# Altium schematic sheet PF1_Alim.SchDoc
size 254 x 228 mm
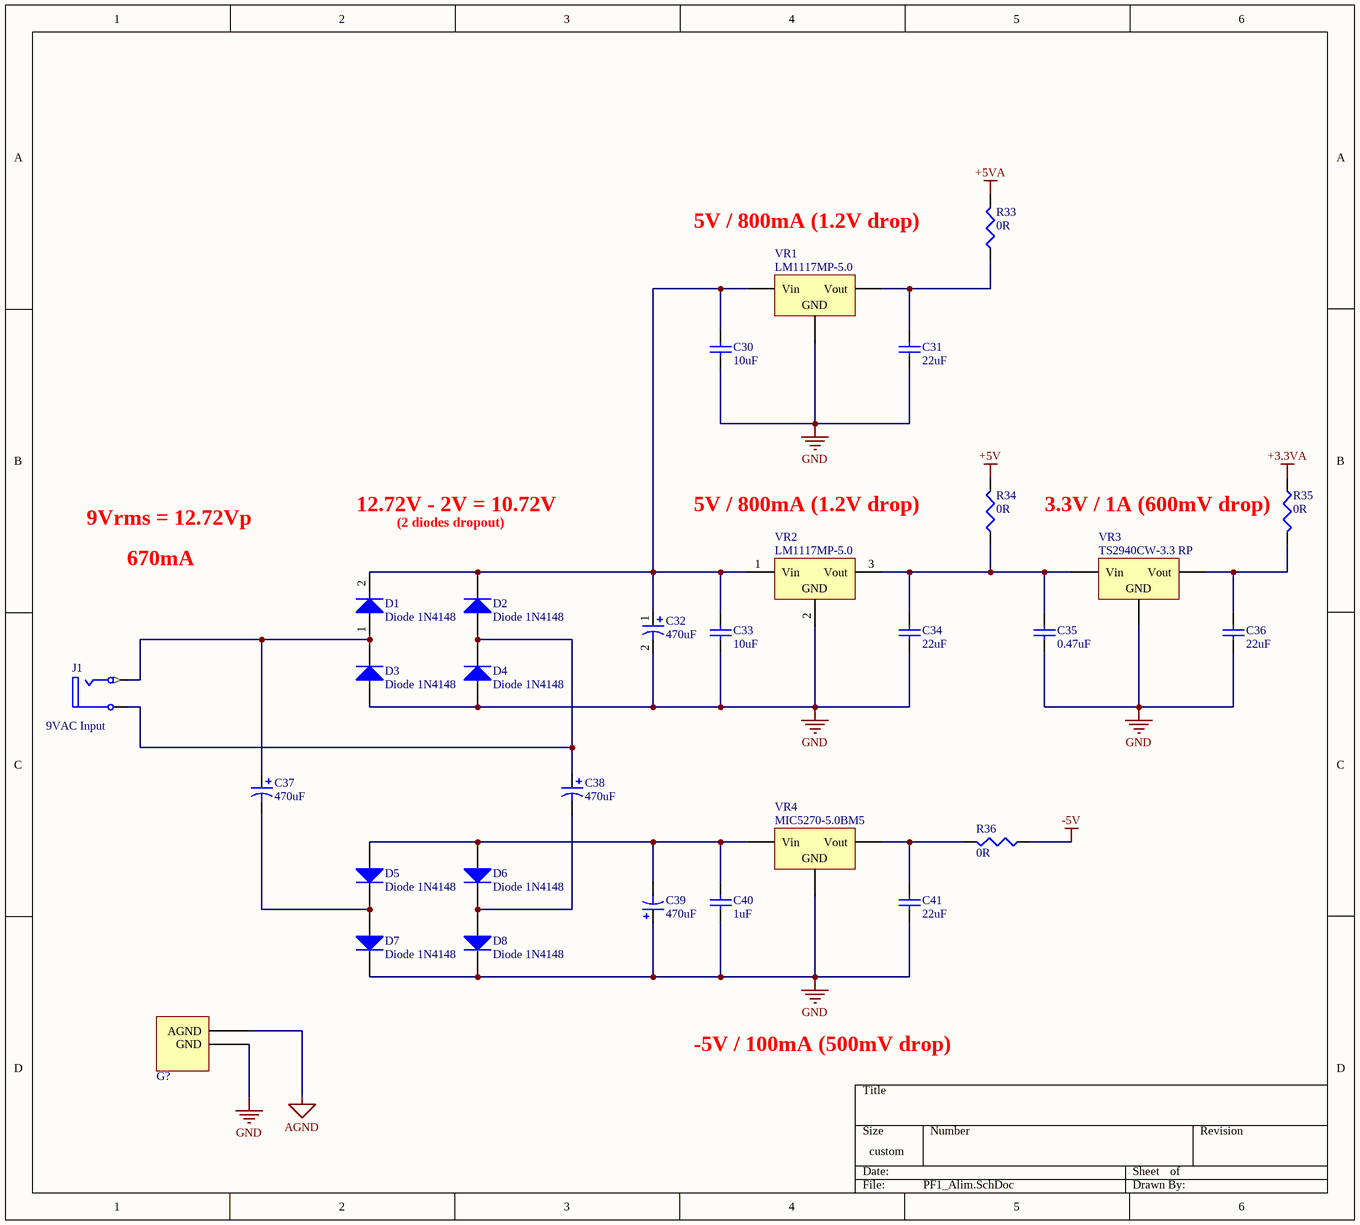
[diagram p0: PF1_Alim.SchDoc]

## Parts
C30  10uF  [CAP 0603 (1608 metric)]
C31  22uF  [CAP 0603 (1608 metric)]
C32  470uF  [Condo Electro 5mm]
C33  10uF  [CAP 0603 (1608 metric)]
C34  22uF  [CAP 0603 (1608 metric)]
C35  0.47uF  [CAP 0603 (1608 metric)]
C36  22uF  [CAP 0603 (1608 metric)]
C37  470uF  [Condo Electro 5mm]
C38  470uF  [Condo Electro 5mm]
C39  470uF  [Condo Electro 5mm]
C40  1uF  [CAP 0603 (1608 metric)]
C41  22uF  [CAP 0603 (1608 metric)]
D1  Diode 1N4148  [1N4148]
D2  Diode 1N4148  [1N4148]
D3  Diode 1N4148  [1N4148]
D4  Diode 1N4148  [1N4148]
D5  Diode 1N4148  [1N4148]
D6  Diode 1N4148  [1N4148]
D7  Diode 1N4148  [1N4148]
D8  Diode 1N4148  [1N4148]
G?  Ground Connector  [GND]  (value not drawn)
J1  9VAC Input  [CLIFF ELECTRONIC COMPONENTS_FC681465P]
R33  0R  [RES 0603 (1608 metric)]
R34  0R  [RES 0603 (1608 metric)]
R35  0R  [RES 0603 (1608 metric)]
R36  0R  [RES 0603 (1608 metric)]
VR1  LM1117MP-5.0  [MP04A]
VR2  LM1117MP-5.0  [MP04A]
VR3  TS2940CW-3.3 RP  [SOT230P715X180-4N]
VR4  MIC5270-5.0BM5  [SOT95P280X130-5N]

## Nets
+3.3VA: R35.1
+5V: R34.2
+5VA: R33.2
-5V: R36.1
AGND: G?.1(AGND)
GND: C30.1 C31.1 C32.2 C33.1 C34.1 C35.1 C36.1 C39.1 C40.1 C41.1 D3.1(A) D4.1(A) D7.2(K) D8.2(K) G?.2(GND) VR1.2(GND) VR2.2(GND) VR3.2(GND) VR4.2(GND)
NetC30_2: C30.2 C32.1 C33.2 D1.2(K) D2.2(K) VR1.1(Vin) VR2.1(Vin)
NetC31_2: C31.2 R33.1 VR1.3(Vout)
NetC34_2: C34.2 C35.2 R34.1 VR2.3(Vout) VR3.1(Vin)
NetC36_2: C36.2 R35.2 VR3.3(Vout)
NetC37_1: C37.1 D1.1(A) D3.2(K) J1.1(T)
NetC37_2: C37.2 D5.2(K) D7.1(A)
NetC38_1: C38.1 D2.1(A) D4.2(K) J1.5(S)
NetC38_2: C38.2 D6.2(K) D8.1(A)
NetC39_2: C39.2 C40.2 D5.1(A) D6.1(A) VR4.1(Vin)
NetC41_2: C41.2 R36.2 VR4.3(Vout)

## Notes on the sheet
- 5V / 800mA (1.2V drop)
- 9Vrms = 12.72Vp
- 670mA
- 12.72V - 2V = 10.72V
- (2 diodes dropout)
- (near R35) 3.3V / 1A (600mV drop)
- -5V / 100mA (500mV drop)

## Library data of the parts
C30 C33 = Cap Semi: Capacitor (Semiconductor SIM Model); Fabricant: MURATA; Fournisseur: Farnell; RefFabricant: GRM188R60J106ME47J; RefFournisseur: 2611921; Value: 10uF; Case: 0603 [1608 Metric]; DataSheet: http://www.farnell.com/datasheets/2079165.pdf
C31 C34 C36 C41 = Cap Semi: Capacitor (Semiconductor SIM Model); Fabricant: MURATA; Fournisseur: Farnell; RefFabricant: GRM188R60J226MEA0D; RefFournisseur: 2666490; Value: 22uF; Case: 0603 [1608 Metric]; DataSheet: http://www.farnell.com/datasheets/1955681.pdf
C32 C37 C38 = Cap Pol1: Polarized Capacitor (Radial); Fabricant: PANASONIC ELECTRONIC COMPONENTS; Fournisseur: Farnell; RefFabricant: EEEFK1E471P; RefFournisseur: 9695800; Value: 470uF; Case: [10mm]; DataSheet: http://www.farnell.com/datasheets/2002520.pdf
C35 = Cap Semi: Capacitor (Semiconductor SIM Model); Fabricant: MURATA; Fournisseur: Farnell; RefFabricant: GRM188R61A474KA61D; RefFournisseur: 2695904; Value: 0.47uF; Case: 0603 [1608 Metric]; DataSheet: http://www.farnell.com/datasheets/2191628.pdf
C39 = Cap Pol1: Polarized Capacitor (Radial); Value: 470pf; Fabricant: PANASONIC ELECTRONIC COMPONENTS; Fournisseur: Farnell; RefFabricant: EEEFK1E471P; RefFournisseur: 9695800; Case: [10mm]; DataSheet: http://www.farnell.com/datasheets/2002520.pdf
C40 = Cap Semi: Capacitor (Semiconductor SIM Model); Fabricant: MURATA; Fournisseur: Farnell; RefFabricant: GRM188R60J105KA01D; RefFournisseur: 9527699; Value: 1uF; Case: 0603 [1608 Metric]; DataSheet: http://www.farnell.com/datasheets/2048127.pdf
D1-D8 = Diode 1N4148: High Conductance Fast Diode; Fabricant: MULTICOMP; Fournisseur: Farnell; RefFabricant: 1N4148WS; RefFournisseur: 1466524; DataSheet: http://www.farnell.com/datasheets/1695880.pdf
G? = GND: Ground Ultime
J1 = Phonejack2: Jack Socket Thru-Hole Vertical 2-Conductor Open Circuit; Fabricant: CLIFF ELECTRONIC COMPONENTS; Fournisseur: Farnell; RefFabricant: FC681465P; RefFournisseur: 1854512; DataSheet: http://www.farnell.com/datasheets/1855458.pdf
R33-R36 = Res3: Resistor; Value: 0
VR1 VR2 = Volt Reg: Voltage Regulator; Fabricant: Texas Instrument; Fournisseur: Farnell; RefFournisseur: 9778209; DataSheet: http://www.farnell.com/datasheets/2019100.pdf; RefFabricant: LM1117MP-5.0
VR3 = Volt Reg: Voltage Regulator; Fabricant: TAIWAN SEMICONDUCTOR; Fournisseur: Farnell; RefFournisseur: 7261403; DataSheet: http://www.farnell.com/datasheets/2044143.pdf; RefFabricant: TS2940CW-3.3 RP
VR4 = Volt Reg: Voltage Regulator; Fabricant: MICROCHIP; Fournisseur: Farnell; RefFabricant: MIC5270-5.0YM5-TR; RefFournisseur: 2510308; DataSheet: http://www.farnell.com/datasheets/29611.pdf